# EAGLE design alig (EAGLE 7.5.0)
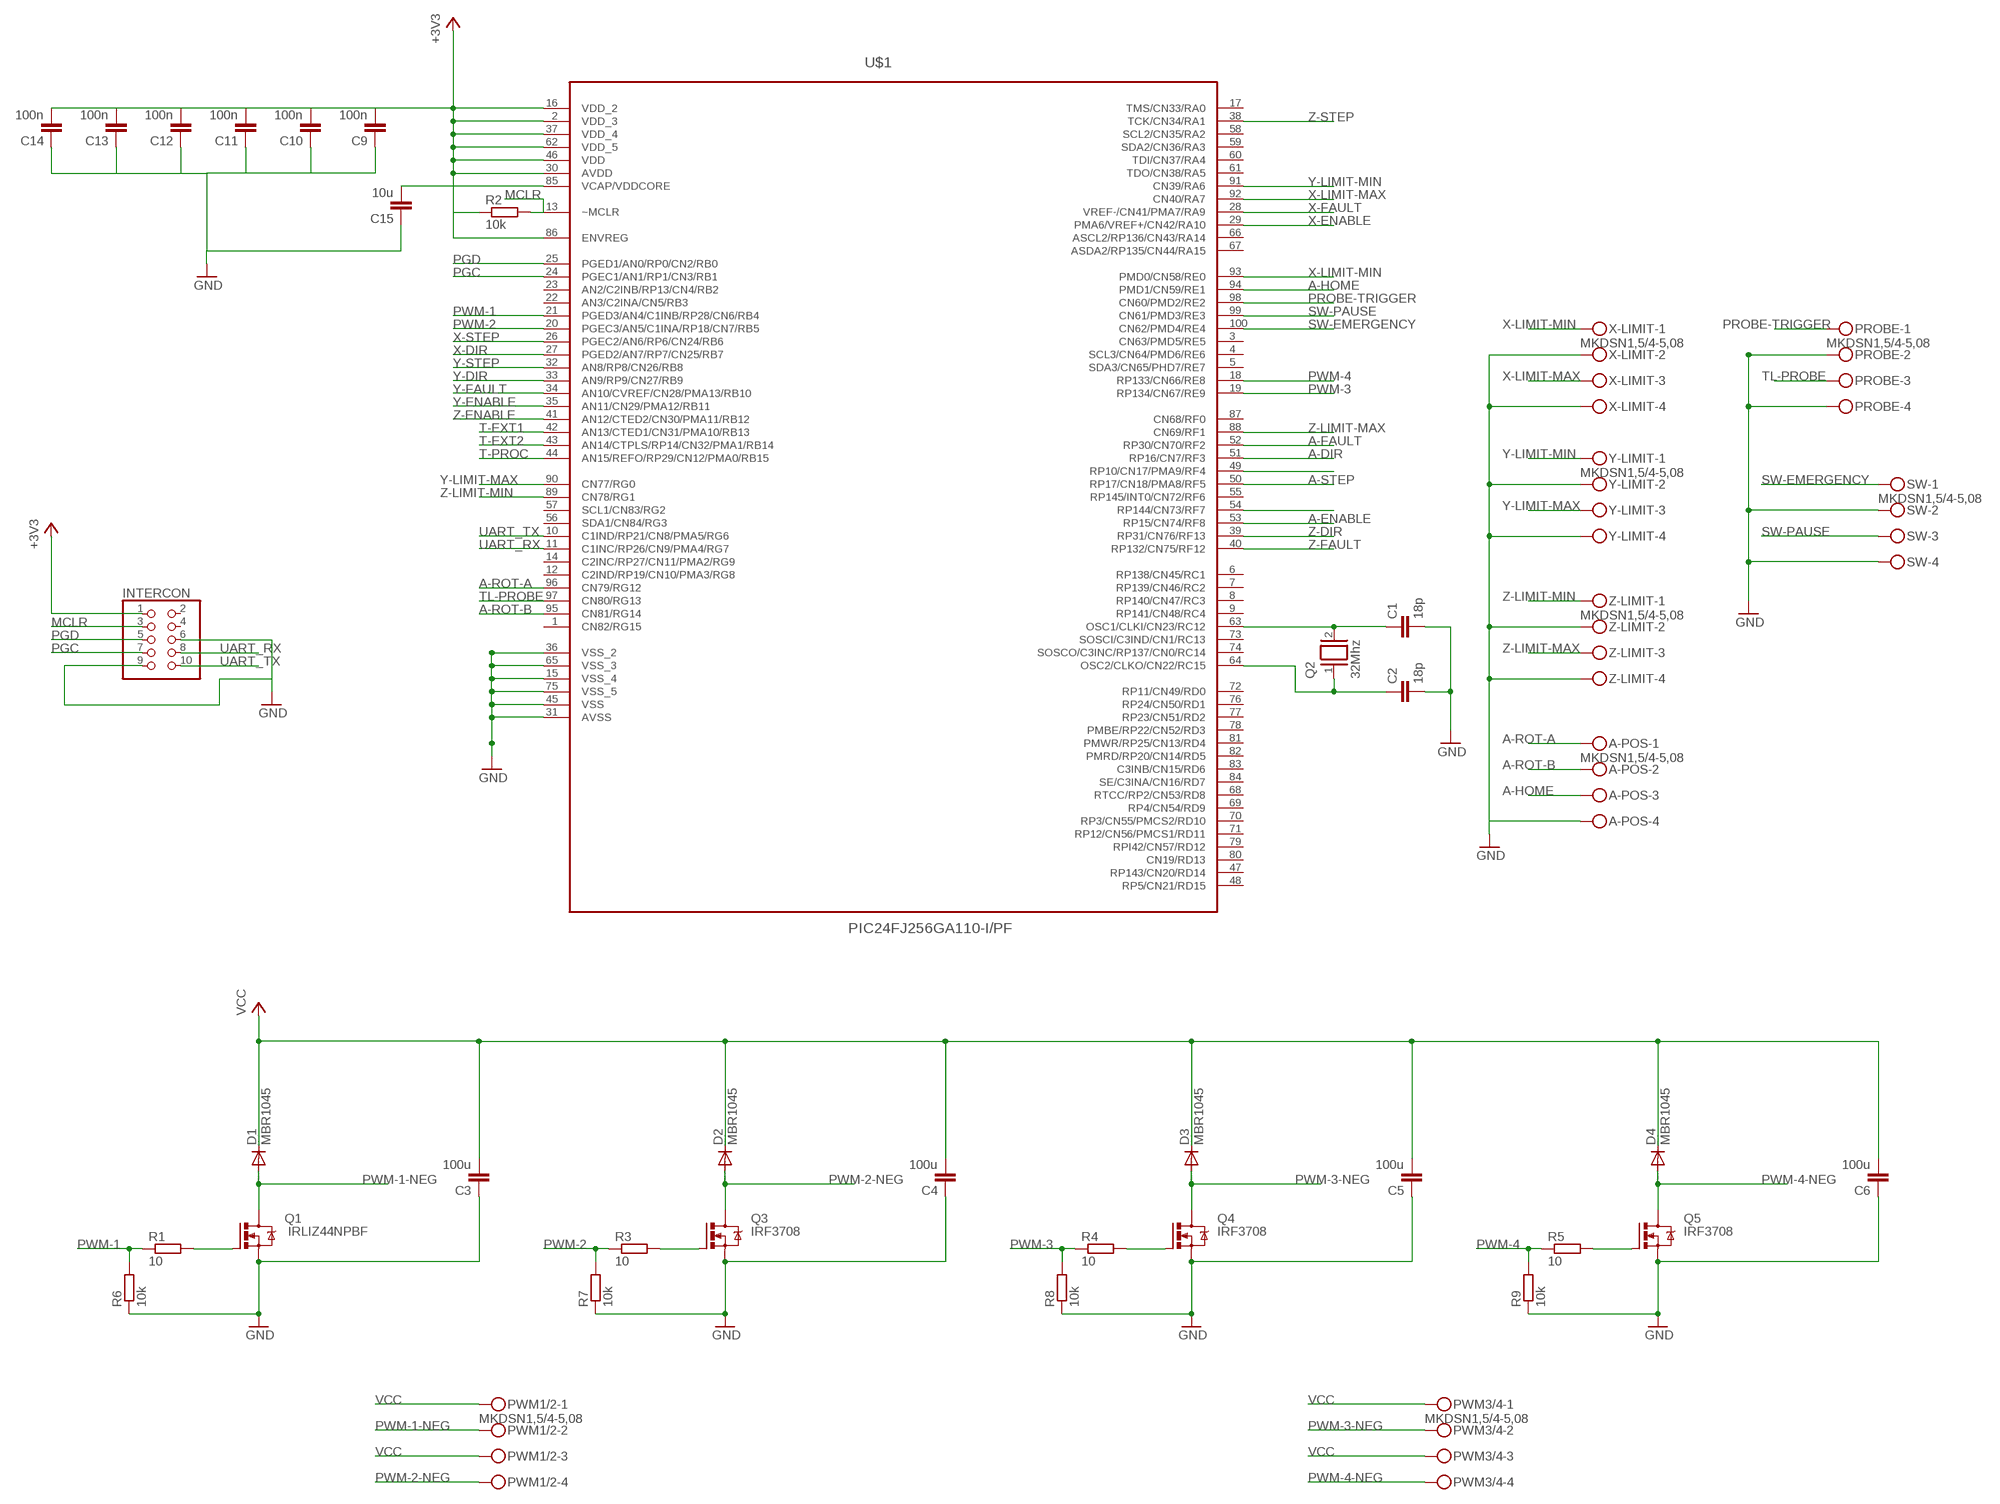
[diagram p0: schematic, sheet 1, part 1 of 3]
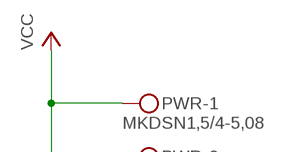
[diagram p1: schematic, sheet 1, part 2 of 3]
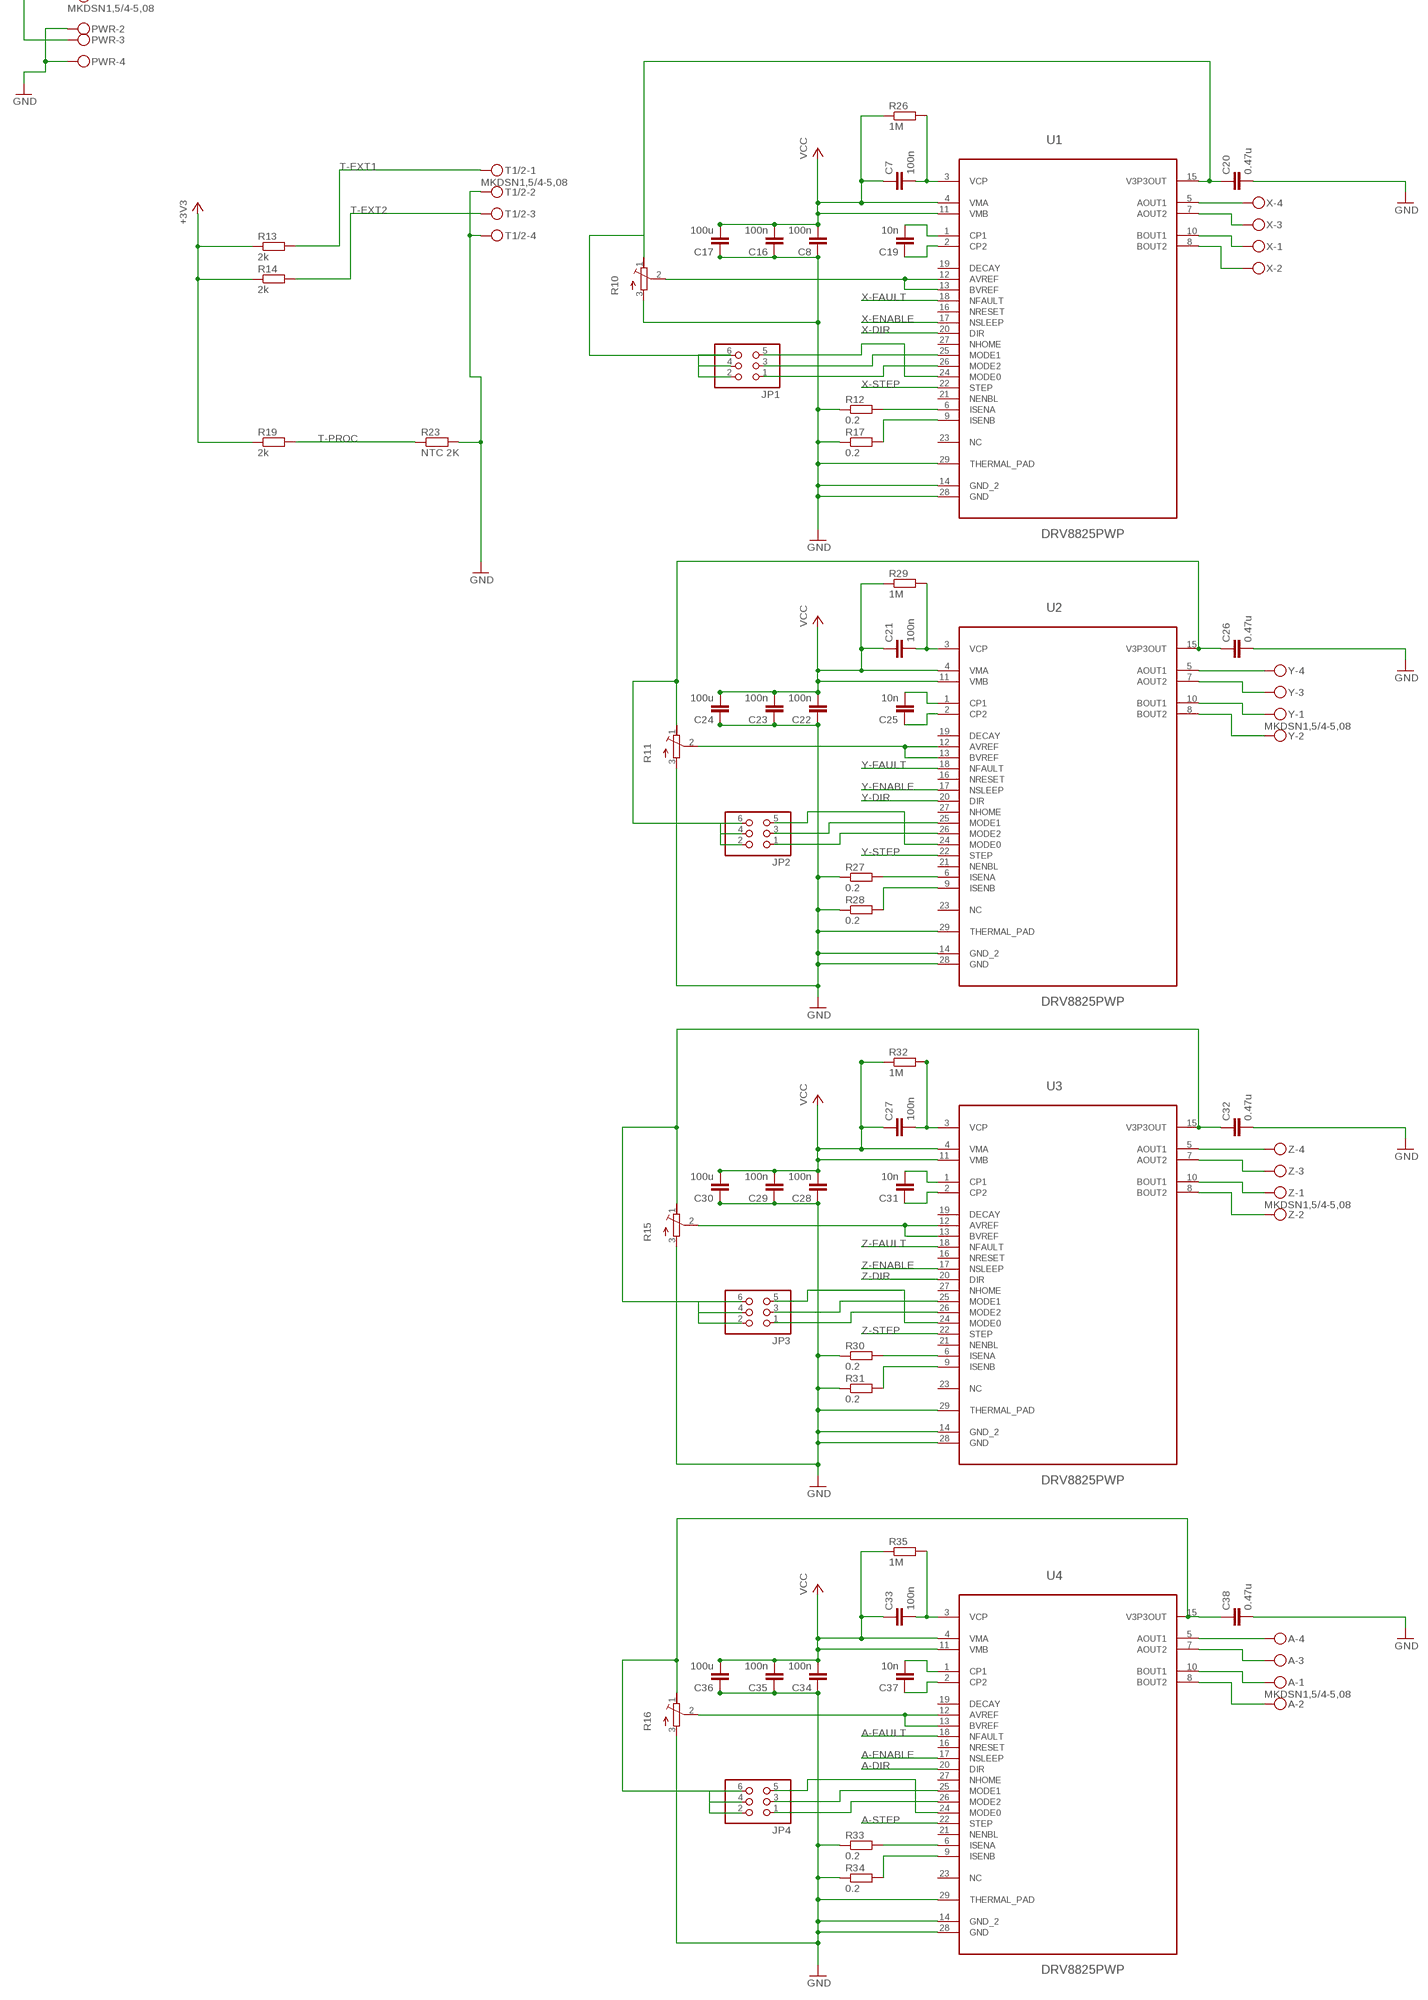
[diagram p2: schematic, sheet 1, part 3 of 3]

## Parts
A  MKDSN1,5/4-5,08  [MKDSN1,5/4-5,08]
A-POS  MKDSN1,5/4-5,08  [MKDSN1,5/4-5,08]
C1  18p  C-EUC0805  [C0805]
C2  18p  C-EUC0805  [C0805]
C3  100u  C-EUC0805  [C0805]
C4  100u  C-EUC0805  [C0805]
C5  100u  C-EUC0805  [C0805]
C6  100u  C-EUC0805  [C0805]
C7  100n  C-EUC0805  [C0805]
C8  100n  C-EUC0805  [C0805]
C9  100n  C-EUC0805  [C0805]
C10  100n  C-EUC0805  [C0805]
C11  100n  C-EUC0805  [C0805]
C12  100n  C-EUC0805  [C0805]
C13  100n  C-EUC0805  [C0805]
C14  100n  C-EUC0805  [C0805]
C15  10u  C-EUC0805  [C0805]
C16  100n  C-EUC0805  [C0805]
C17  100u  C-EUC0805  [C0805]
C19  10n  C-EUC0805  [C0805]
C20  0.47u  C-EUC0805  [C0805]
C21  100n  C-EUC0805  [C0805]
C22  100n  C-EUC0805  [C0805]
C23  100n  C-EUC0805  [C0805]
C24  100u  C-EUC0805  [C0805]
C25  10n  C-EUC0805  [C0805]
C26  0.47u  C-EUC0805  [C0805]
C27  100n  C-EUC0805  [C0805]
C28  100n  C-EUC0805  [C0805]
C29  100n  C-EUC0805  [C0805]
C30  100u  C-EUC0805  [C0805]
C31  10n  C-EUC0805  [C0805]
C32  0.47u  C-EUC0805  [C0805]
C33  100n  C-EUC0805  [C0805]
C34  100n  C-EUC0805  [C0805]
C35  100n  C-EUC0805  [C0805]
C36  100u  C-EUC0805  [C0805]
C37  10n  C-EUC0805  [C0805]
C38  0.47u  C-EUC0805  [C0805]
D1  MBR1045  BYT08P  [TO220ACS]
D2  MBR1045  BYT08P  [TO220ACS]
D3  MBR1045  BYT08P  [TO220ACS]
D4  MBR1045  BYT08P  [TO220ACS]
INTERCON  PINHD-2X5  [2X05]
JP1  PINHD-2X3  [2X03]
JP2  PINHD-2X3  [2X03]
JP3  PINHD-2X3  [2X03]
JP4  PINHD-2X3  [2X03]
PROBE  MKDSN1,5/4-5,08  [MKDSN1,5/4-5,08]
PWM1/2  MKDSN1,5/4-5,08  [MKDSN1,5/4-5,08]
PWM3/4  MKDSN1,5/4-5,08  [MKDSN1,5/4-5,08]
PWR  MKDSN1,5/4-5,08  [MKDSN1,5/4-5,08]
Q1  IRLIZ44NPBF  IRF540  [TO220BV]
Q2  32Mhz  XTAL/S  [QS]
Q3  IRF3708  IRF540  [TO220BV]
Q4  IRF3708  IRF540  [TO220BV]
Q5  IRF3708  IRF540  [TO220BV]
R1  10  R-EU_R0805  [R0805]
R2  10k  R-EU_R0805  [R0805]
R3  10  R-EU_R0805  [R0805]
R4  10  R-EU_R0805  [R0805]
R5  10  R-EU_R0805  [R0805]
R6  10k  R-EU_R0805  [R0805]
R7  10k  R-EU_R0805  [R0805]
R8  10k  R-EU_R0805  [R0805]
R9  10k  R-EU_R0805  [R0805]
R10  R-TRIMM3314J  [RTRIM3314J]
R11  R-TRIMM3314J  [RTRIM3314J]
R12  0.2  R-EU_R1206  [R1206]
R13  2k  R-EU_R0805  [R0805]
R14  2k  R-EU_R0805  [R0805]
R15  R-TRIMM3314J  [RTRIM3314J]
R16  R-TRIMM3314J  [RTRIM3314J]
R17  0.2  R-EU_R1206  [R1206]
R19  2k  R-EU_R0805  [R0805]
R23  NTC 2K  R-EU_R0805  [R0805]
R26  1M  R-EU_R0805  [R0805]
R27  0.2  R-EU_R1206  [R1206]
R28  0.2  R-EU_R1206  [R1206]
R29  1M  R-EU_R0805  [R0805]
R30  0.2  R-EU_R1206  [R1206]
R31  0.2  R-EU_R1206  [R1206]
R32  1M  R-EU_R0805  [R0805]
R33  0.2  R-EU_R1206  [R1206]
R34  0.2  R-EU_R1206  [R1206]
R35  1M  R-EU_R0805  [R0805]
SW  MKDSN1,5/4-5,08  [MKDSN1,5/4-5,08]
T1/2  MKDSN1,5/4-5,08  [MKDSN1,5/4-5,08]
U1  DRV8825PWP  [SOP65P640X120-29N]
U2  DRV8825PWP  [SOP65P640X120-29N]
U3  DRV8825PWP  [SOP65P640X120-29N]
U4  DRV8825PWP  [SOP65P640X120-29N]
U$1  PIC24FJ256GA110-I/PF  [QFP50P1600X1600X120-100N]
X  MKDSN1,5/4-5,08  [MKDSN1,5/4-5,08]
X-LIMIT  MKDSN1,5/4-5,08  [MKDSN1,5/4-5,08]
Y  MKDSN1,5/4-5,08  [MKDSN1,5/4-5,08]
Y-LIMIT  MKDSN1,5/4-5,08  [MKDSN1,5/4-5,08]
Z  MKDSN1,5/4-5,08  [MKDSN1,5/4-5,08]
Z-LIMIT  MKDSN1,5/4-5,08  [MKDSN1,5/4-5,08]

## Nets
+3V3: C9.2 C10.2 C11.2 C12.2 C13.2 C14.2 INTERCON.1 R2.1 R13.1 R14.1 R19.1 U$1.2(VDD_3) U$1.16(VDD_2) U$1.30(AVDD) U$1.37(VDD_4) U$1.46(VDD) U$1.62(VDD_5) U$1.86(ENVREG)
A-DIR: U4.20(DIR) U$1.51(RP16/CN7/RF3)
A-ENABLE: U4.17(NSLEEP) U$1.53(RP15/CN74/RF8)
A-FAULT: U4.18(NFAULT) U$1.52(RP30/CN70/RF2)
A-HOME: A-POS.3 U$1.94(PMD1/CN59/RE1)
A-ROT-A: A-POS.1 U$1.96(CN79/RG12)
A-ROT-B: A-POS.2 U$1.95(CN81/RG14)
A-STEP: U4.22(STEP) U$1.50(RP17/CN18/PMA8/RF5)
AUX-IO-3: U$1.54(RP144/CN73/RF7)
GND: A-POS.4 C1.2 C2.2 C3.1 C4.1 C5.1 C6.1 C8.1 C9.1 C10.1 C11.1 C12.1 C13.1 C14.1 C15.1 C16.1 C17.1 C20.2 C22.1 C23.1 C24.1 C26.2 C28.1 C29.1 C30.1 C32.2 C34.1 C35.1 C36.1 C38.2 INTERCON.6 INTERCON.9 PROBE.2 PROBE.4 PWR.2 PWR.4 Q1.S Q3.S Q4.S Q5.S R6.1 R7.1 R8.1 R9.1 R10.3(A) R11.3(A) R12.1 R15.3(A) R16.3(A) R17.1 R23.2 R27.1 R28.1 R30.1 R31.1 R33.1 R34.1 SW.2 SW.4 T1/2.2 T1/2.4 U1.14(GND_2) U1.28(GND) U1.29(THERMAL_PAD) U2.14(GND_2) U2.28(GND) U2.29(THERMAL_PAD) U3.14(GND_2) U3.28(GND) U3.29(THERMAL_PAD) U4.14(GND_2) U4.28(GND) U4.29(THERMAL_PAD) U$1.15(VSS_4) U$1.31(AVSS) U$1.36(VSS_2) U$1.45(VSS) U$1.65(VSS_3) U$1.75(VSS_5) X-LIMIT.2 X-LIMIT.4 Y-LIMIT.2 Y-LIMIT.4 Z-LIMIT.2 Z-LIMIT.4
MCLR: INTERCON.3 R2.2 U$1.13(~MCLR)
N$1: U1.5(AOUT1) X.4
N$2: Q3.G R3.2
N$3: Q4.G R4.2
N$4: C2.1 Q2.1 U$1.64(OSC2/CLKO/CN22/RC15)
N$5: C1.1 Q2.2 U$1.63(OSC1/CLKI/CN23/RC12)
N$6: C15.2 U$1.85(VCAP/VDDCORE)
N$7: Q1.G R1.2
N$8: Q5.G R5.2
N$9: U1.7(AOUT2) X.3
N$10: U1.10(BOUT1) X.1
N$11: U1.8(BOUT2) X.2
N$12: U2.5(AOUT1) Y.4
N$13: U2.7(AOUT2) Y.3
N$14: U2.10(BOUT1) Y.1
N$15: U2.8(BOUT2) Y.2
N$16: U3.5(AOUT1) Z.4
N$17: C21.2 R29.2 U2.3(VCP)
N$18: C25.2 U2.1(CP1)
N$19: C25.1 U2.2(CP2)
N$20: C7.2 R26.2 U1.3(VCP)
N$21: C26.1 JP2.2 JP2.4 JP2.6 R11.1(E) U2.15(V3P3OUT)
N$22: C19.2 U1.1(CP1)
N$23: C19.1 U1.2(CP2)
N$24: JP2.1 U2.26(MODE2)
N$25: R27.2 U2.6(ISENA)
N$26: R12.2 U1.6(ISENA)
N$27: R17.2 U1.9(ISENB)
N$28: R28.2 U2.9(ISENB)
N$29: U3.7(AOUT2) Z.3
N$30: U3.10(BOUT1) Z.1
N$31: U3.8(BOUT2) Z.2
N$32: A.4 U4.5(AOUT1)
N$33: C27.2 R32.2 U3.3(VCP)
N$34: C31.2 U3.1(CP1)
N$35: C31.1 U3.2(CP2)
N$36: C32.1 JP3.2 JP3.4 JP3.6 R15.1(E) U3.15(V3P3OUT)
N$37: R30.2 U3.6(ISENA)
N$38: R31.2 U3.9(ISENB)
N$39: A.3 U4.7(AOUT2)
N$40: A.1 U4.10(BOUT1)
N$41: A.2 U4.8(BOUT2)
N$42: R10.2(S) U1.12(AVREF) U1.13(BVREF)
N$43: C33.2 R35.2 U4.3(VCP)
N$44: C37.2 U4.1(CP1)
N$45: C37.1 U4.2(CP2)
N$46: C38.1 JP4.2 JP4.4 JP4.6 R16.1(E) U4.15(V3P3OUT)
N$47: R33.2 U4.6(ISENA)
N$48: R34.2 U4.9(ISENB)
N$49: JP1.5 U1.24(MODE0)
N$50: R11.2(S) U2.12(AVREF) U2.13(BVREF)
N$51: R15.2(S) U3.12(AVREF) U3.13(BVREF)
N$52: R16.2(S) U4.12(AVREF) U4.13(BVREF)
N$53: JP1.3 U1.25(MODE1)
N$54: JP2.5 U2.24(MODE0)
N$55: JP1.1 U1.26(MODE2)
N$56: C20.1 JP1.2 JP1.4 JP1.6 R10.1(E) U1.15(V3P3OUT)
N$57: JP2.3 U2.25(MODE1)
N$58: JP3.5 U3.24(MODE0)
N$59: JP3.3 U3.25(MODE1)
N$60: JP3.1 U3.26(MODE2)
N$61: JP4.5 U4.24(MODE0)
N$62: JP4.3 U4.25(MODE1)
N$63: JP4.1 U4.26(MODE2)
PGC: INTERCON.7 U$1.24(PGEC1/AN1/RP1/CN3/RB1)
PGD: INTERCON.5 U$1.25(PGED1/AN0/RP0/CN2/RB0)
PROBE-TRIGGER: PROBE.1 U$1.98(CN60/PMD2/RE2)
PWM-1: R1.1 R6.2 U$1.21(PGED3/AN4/C1INB/RP28/CN6/RB4)
PWM-1-NEG: D1.A PWM1/2.2 Q1.D
PWM-2: R3.1 R7.2 U$1.20(PGEC3/AN5/C1INA/RP18/CN7/RB5)
PWM-2-NEG: D2.A PWM1/2.4 Q3.D
PWM-3: R4.1 R8.2 U$1.19(RP134/CN67/RE9)
PWM-3-NEG: D3.A PWM3/4.2 Q4.D
PWM-4: R5.1 R9.2 U$1.18(RP133/CN66/RE8)
PWM-4-NEG: D4.A PWM3/4.4 Q5.D
SW-EMERGENCY: SW.1 U$1.100(CN62/PMD4/RE4)
SW-PAUSE: SW.3 U$1.99(CN61/PMD3/RE3)
T-EXT1: R13.2 T1/2.1 U$1.42(AN13/CTED1/CN31/PMA10/RB13)
T-EXT2: R14.2 T1/2.3 U$1.43(AN14/CTPLS/RP14/CN32/PMA1/RB14)
T-PROC: R19.2 R23.1 U$1.44(AN15/REFO/RP29/CN12/PMA0/RB15)
TL-PROBE: PROBE.3 U$1.97(CN80/RG13)
UART_RX: INTERCON.8 U$1.11(C1INC/RP26/CN9/PMA4/RG7)
UART_TX: INTERCON.10 U$1.10(C1IND/RP21/CN8/PMA5/RG6)
VCC: C3.2 C4.2 C5.2 C6.2 C7.1 C8.2 C16.2 C17.2 C21.1 C22.2 C23.2 C24.2 C27.1 C28.2 C29.2 C30.2 C33.1 C34.2 C35.2 C36.2 D1.C D2.C D3.C D4.C PWM1/2.1 PWM1/2.3 PWM3/4.1 PWM3/4.3 PWR.1 PWR.3 R26.1 R29.1 R32.1 R35.1 U1.4(VMA) U1.11(VMB) U2.4(VMA) U2.11(VMB) U3.4(VMA) U3.11(VMB) U4.4(VMA) U4.11(VMB)
X-DIR: U1.20(DIR) U$1.27(PGED2/AN7/RP7/CN25/RB7)
X-ENABLE: U1.17(NSLEEP) U$1.29(PMA6/VREF+/CN42/RA10)
X-FAULT: U1.18(NFAULT) U$1.28(VREF-/CN41/PMA7/RA9)
X-LIMIT-MAX: U$1.92(CN40/RA7) X-LIMIT.3
X-LIMIT-MIN: U$1.93(PMD0/CN58/RE0) X-LIMIT.1
X-STEP: U1.22(STEP) U$1.26(PGEC2/AN6/RP6/CN24/RB6)
Y-DIR: U2.20(DIR) U$1.33(AN9/RP9/CN27/RB9)
Y-ENABLE: U2.17(NSLEEP) U$1.35(AN11/CN29/PMA12/RB11)
Y-FAULT: U2.18(NFAULT) U$1.34(AN10/CVREF/CN28/PMA13/RB10)
Y-LIMIT-MAX: U$1.90(CN77/RG0) Y-LIMIT.3
Y-LIMIT-MIN: U$1.91(CN39/RA6) Y-LIMIT.1
Y-STEP: U2.22(STEP) U$1.32(AN8/RP8/CN26/RB8)
Z-DIR: U3.20(DIR) U$1.39(RP31/CN76/RF13)
Z-ENABLE: U3.17(NSLEEP) U$1.41(AN12/CTED2/CN30/PMA11/RB12)
Z-FAULT: U3.18(NFAULT) U$1.40(RP132/CN75/RF12)
Z-LIMIT-MAX: U$1.88(CN69/RF1) Z-LIMIT.3
Z-LIMIT-MIN: U$1.89(CN78/RG1) Z-LIMIT.1
Z-STEP: U3.22(STEP) U$1.38(TCK/CN34/RA1)
ZTL-PROBE: U$1.49(RP10/CN17/PMA9/RF4)
Unconnected: INTERCON.2 INTERCON.4 U1.16(NRESET) U1.19(DECAY) U1.21(NENBL) U1.23(NC) U1.27(NHOME) U2.16(NRESET) U2.19(DECAY) U2.21(NENBL) U2.23(NC) U2.27(NHOME) U3.16(NRESET) U3.19(DECAY) U3.21(NENBL) U3.23(NC) U3.27(NHOME) U4.16(NRESET) U4.19(DECAY) U4.21(NENBL) U4.23(NC) U4.27(NHOME) U$1.1(CN82/RG15) U$1.3(CN63/PMD5/RE5) U$1.4(SCL3/CN64/PMD6/RE6) U$1.5(SDA3/CN65/PHD7/RE7) U$1.6(RP138/CN45/RC1) U$1.7(RP139/CN46/RC2) U$1.8(RP140/CN47/RC3) U$1.9(RP141/CN48/RC4) U$1.12(C2IND/RP19/CN10/PMA3/RG8) U$1.14(C2INC/RP27/CN11/PMA2/RG9) U$1.17(TMS/CN33/RA0) U$1.22(AN3/C2INA/CN5/RB3) U$1.23(AN2/C2INB/RP13/CN4/RB2) U$1.47(RP143/CN20/RD14) U$1.48(RP5/CN21/RD15) U$1.55(RP145/INT0/CN72/RF6) U$1.56(SDA1/CN84/RG3) U$1.57(SCL1/CN83/RG2) U$1.58(SCL2/CN35/RA2) U$1.59(SDA2/CN36/RA3) U$1.60(TDI/CN37/RA4) U$1.61(TDO/CN38/RA5) U$1.66(ASCL2/RP136/CN43/RA14) U$1.67(ASDA2/RP135/CN44/RA15) U$1.68(RTCC/RP2/CN53/RD8) U$1.69(RP4/CN54/RD9) U$1.70(RP3/CN55/PMCS2/RD10) U$1.71(RP12/CN56/PMCS1/RD11) U$1.72(RP11/CN49/RD0) U$1.73(SOSCI/C3IND/CN1/RC13) U$1.74(SOSCO/C3INC/RP137/CN0/RC14) U$1.76(RP24/CN50/RD1) U$1.77(RP23/CN51/RD2) U$1.78(PMBE/RP22/CN52/RD3) U$1.79(RPI42/CN57/RD12) U$1.80(CN19/RD13) U$1.81(PMWR/RP25/CN13/RD4) U$1.82(PMRD/RP20/CN14/RD5) U$1.83(C3INB/CN15/RD6) U$1.84(SE/C3INA/CN16/RD7) U$1.87(CN68/RF0)

## Library data of the parts
A A-POS PROBE PWM1/2 PWM3/4 PWR SW T1/2 X X-LIMIT Y Y-LIMIT Z Z-LIMIT = con-phoenix-508:MKDSN1,5/4-5,08: MKDSN 1,5/ 4-5,08 Printklemme Nennstrom: 13,5 A Nennspannung: 250 V Rastermaß: 5,08 mm Polzahl: 4 Anschlussart: Schraubanschluss Montage: Löten Anschlussrichtung Leiter/Platine: 0 ° Artikelnummer: 1729144 Source: http://eshop.phoenixcontact.com .. 1729144.pdf
C1-C17 C19-C38 = resistor:C-EU: CAPACITOR, European symbol
D1-D4 = diode:BYT08P: DIODE ultra fast
INTERCON = pinhead:PINHD-2X5: PIN HEADER
JP1-JP4 = pinhead:PINHD-2X3: PIN HEADER
Q1 Q3-Q5 = transistor-power:IRF540: HEXFET Power MOSFET
Q2 = special:XTAL/S: CRYSTAL
R1-R9 R13 R14 R19 R23 R26 R29 R32 R35 = resistor:R-EU_: RESISTOR, European symbol
R10 R11 R15 R16 = rcl:R-TRIMM: Trimm resistor
R12 R17 R27 R28 R30 R31 R33 R34 = rcl:R-EU_: RESISTOR, European symbol
U1-U4 = DRV8825:DRV8825PWP: STEPPER MOTOR CONTROLLER IC,HTSSOP-28; MPN: DRV8825PWP; OC_FARNELL: 1903642; OC_NEWARK: 48T4143; PACKAGE: HTSSOP-28; SUPPLIER: TEXAS INSTRUMENTS
U$1 = pic24fj256ga110:PIC24FJ256GA110-I/PF: IC, 16BIT MCU; DESCRIPTION: IC, 16BIT MCU; MPN: PIC24FJ256GA110-I/PF; OC_FARNELL: 1576866; OC_NEWARK: 54M5125; PACKAGE: TQFP-100; SUPPLIER: Microchip

## Board
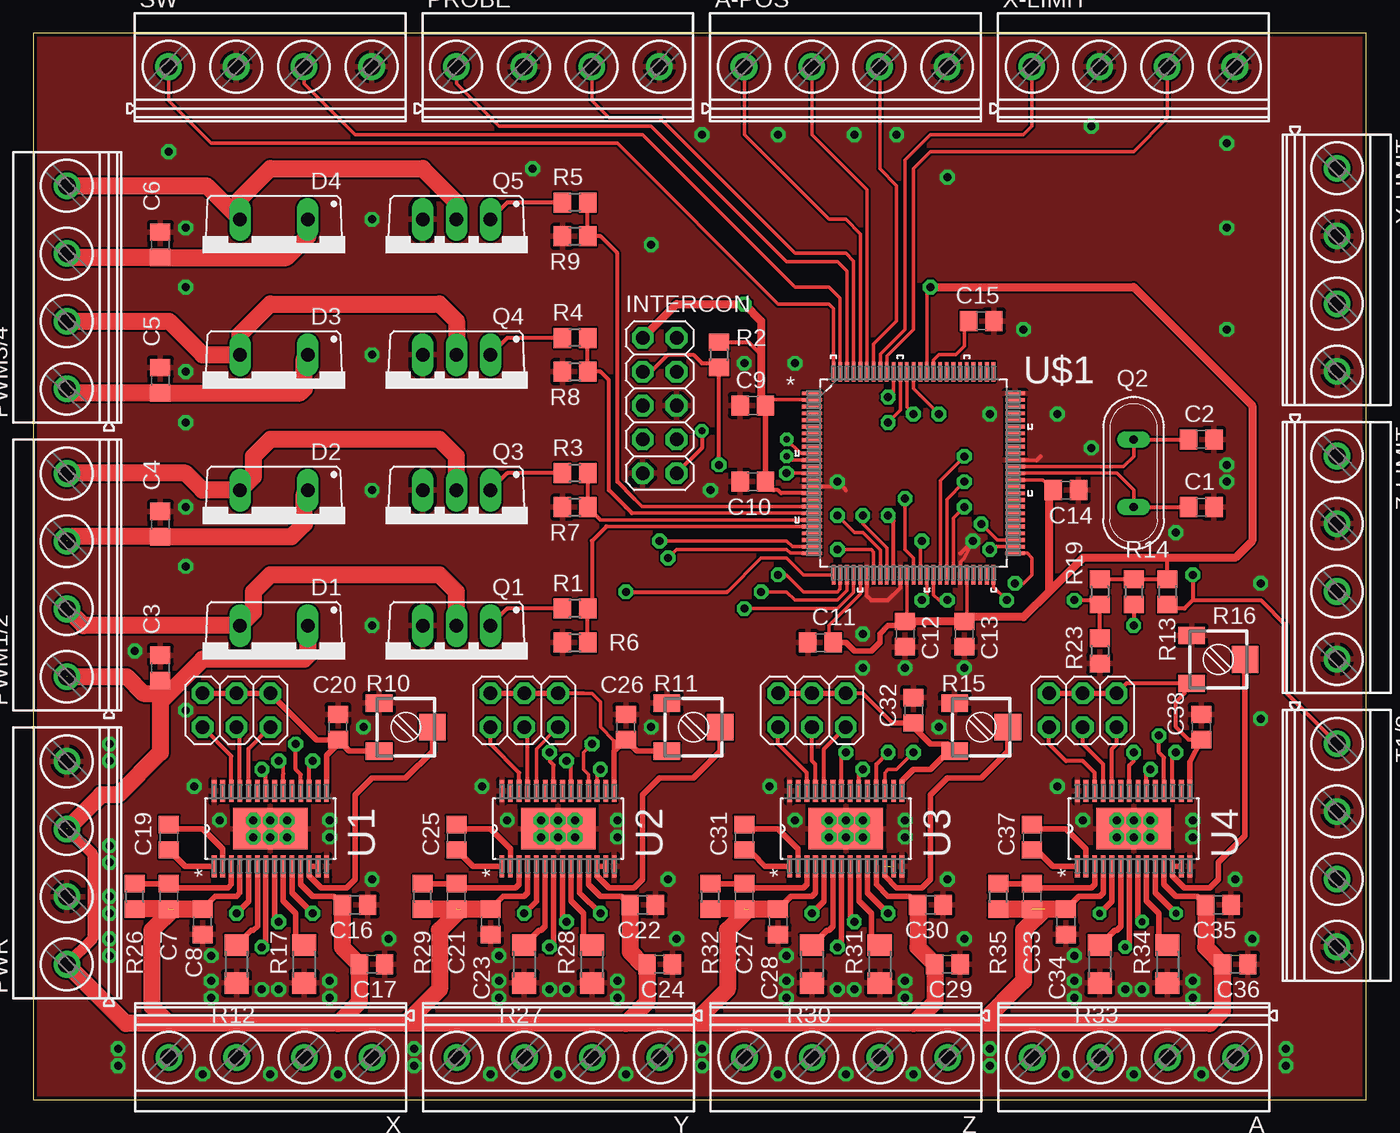
[diagram p3: board, top side]
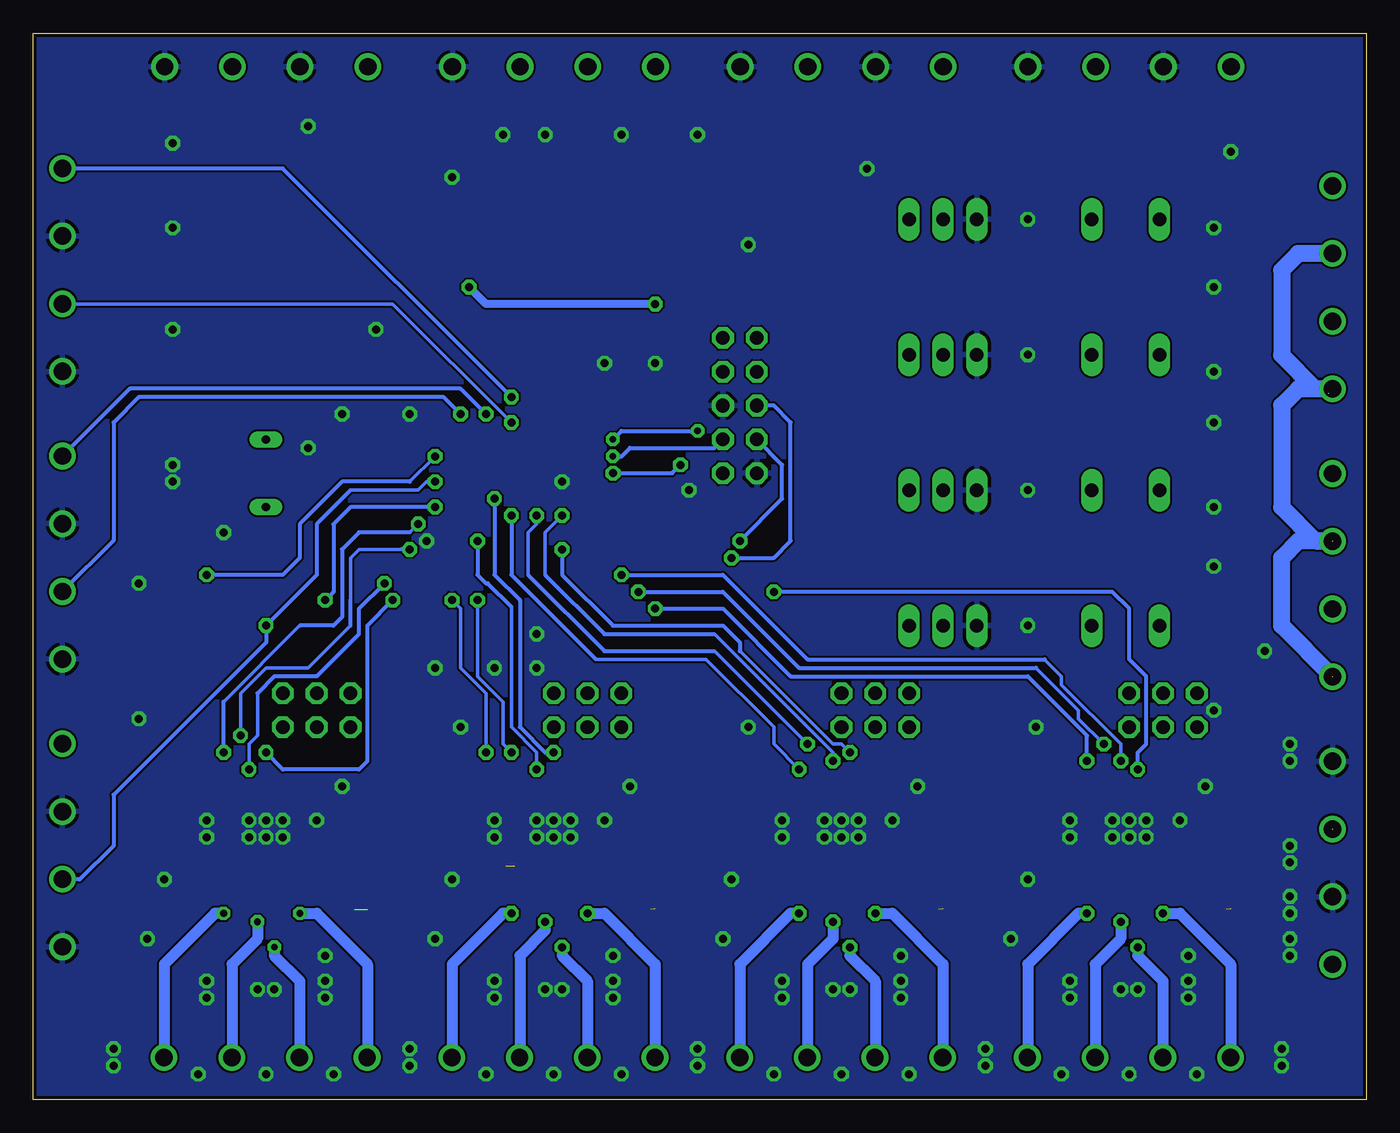
[diagram p4: board, bottom side, seen from below]

Size 100 x 80 mm. Coordinates in mm from the lower left corner, seen from the top.
Outline: 0,0 100,0 100,80 0,80 0,0
Copper layers (1*16): Top 0.035mm / dielectric 1.5mm / Bottom 0.035mm
Design rules "SparkFun *": minimum track width 8mil, minimum drill 20mil, track to track 6mil, track to pad 8mil, pad to pad 8mil, via to via 8mil, smd to smd 8mil, copper to edge 10mil, drill to drill 8mil, minimum pad ring 12mil, minimum via ring 10mil, stop-mask expansion 4mil, vias tented up to drill 25mil, thermal gap 10mil

### Footprints (pad centres in the part's own frame; a part is rotated, then mirrored left to right if it is on the bottom)
MKDSN1,5/4-5,08 = drill 1.3 pad 2: 1 -7.641,0.025; 2 -2.561,0.025; 3 2.519,0.025; 4 7.599,0.025
C0805 = smd 1.3 x 1.5: 1 -0.95,0; 2 0.95,0
TO220ACS = drill 1.016 long: A 2.54,-2.54; C -2.54,-2.54
2X05 = drill 1.016 octagon: 1 -5.08,-1.27; 2 -5.08,1.27; 3 -2.54,-1.27; 4 -2.54,1.27; 5 0,-1.27; 6 0,1.27; 7 2.54,-1.27; 8 2.54,1.27; 9 5.08,-1.27; 10 5.08,1.27
2X03 = drill 1.016 octagon: 1 -2.54,-1.27; 2 -2.54,1.27; 3 0,-1.27; 4 0,1.27; 5 2.54,-1.27; 6 2.54,1.27
TO220BV = drill 1.016 long: D 0,-2.54; G -2.54,-2.54; S 2.54,-2.54
QS = drill 0.61 long: 1 -2.54,0; 2 2.54,0
R0805 = smd 1.3 x 1.5: 1 -0.95,0; 2 0.95,0
RTRIM3314J = smd 1.3 x 2: 1 1.8,-2; 3 -1.8,-2 | smd 2 x 2: 2 0,2
R1206 = smd 1.6 x 1.803: 1 -1.422,0; 2 1.422,0
SOP65P640X120-29N = smd 1.651 x 0.356: 1 -2.819,4.216; 2 -2.819,3.581; 3 -2.819,2.921; 4 -2.819,2.286; 5 -2.819,1.626; 6 -2.819,0.965; 7 -2.819,0.33; 8 -2.819,-0.33; 9 -2.819,-0.965; 10 -2.819,-1.626; 11 -2.819,-2.286; 12 -2.819,-2.921; 13 -2.819,-3.581; 14 -2.819,-4.216; 15 2.819,-4.216; 16 2.819,-3.581; 17 2.819,-2.921; 18 2.819,-2.286; 19 2.819,-1.626; 20 2.819,-0.965; 21 2.819,-0.33; 22 2.819,0.33; 23 2.819,0.965; 24 2.819,1.626; 25 2.819,2.286; 26 2.819,2.921; 27 2.819,3.581; 28 2.819,4.216 | smd 3.099 x 5.588: 29 0,0
QFP50P1600X1600X120-100N = smd 1.473 x 0.279: 1 -7.62,5.994; 2 -7.62,5.512; 3 -7.62,5.004; 4 -7.62,4.496; 5 -7.62,3.988; 6 -7.62,3.505; 7 -7.62,2.997; 8 -7.62,2.489; 9 -7.62,2.007; 10 -7.62,1.499; 11 -7.62,0.991; 12 -7.62,0.508; 13 -7.62,0; 14 -7.62,-0.508; 15 -7.62,-0.991; 16 -7.62,-1.499; 17 -7.62,-2.007; 18 -7.62,-2.489; 19 -7.62,-2.997; 20 -7.62,-3.505; 21 -7.62,-3.988; 22 -7.62,-4.496; 23 -7.62,-5.004; 24 -7.62,-5.512; 25 -7.62,-5.994; 51 7.62,-5.994; 52 7.62,-5.512; 53 7.62,-5.004; 54 7.62,-4.496; 55 7.62,-3.988; 56 7.62,-3.505; 57 7.62,-2.997; 58 7.62,-2.489; 59 7.62,-2.007; 60 7.62,-1.499; 61 7.62,-0.991; 62 7.62,-0.508; 63 7.62,0; 64 7.62,0.508; 65 7.62,0.991; 66 7.62,1.499; 67 7.62,2.007; 68 7.62,2.489; 69 7.62,2.997; 70 7.62,3.505; 71 7.62,3.988; 72 7.62,4.496; 73 7.62,5.004; 74 7.62,5.512; 75 7.62,5.994 | smd 0.279 x 1.473: 26 -5.994,-7.62; 27 -5.512,-7.62; 28 -5.004,-7.62; 29 -4.496,-7.62; 30 -3.988,-7.62; 31 -3.505,-7.62; 32 -2.997,-7.62; 33 -2.489,-7.62; 34 -2.007,-7.62; 35 -1.499,-7.62; 36 -0.991,-7.62; 37 -0.508,-7.62; 38 0,-7.62; 39 0.508,-7.62; 40 0.991,-7.62; 41 1.499,-7.62; 42 2.007,-7.62; 43 2.489,-7.62; 44 2.997,-7.62; 45 3.505,-7.62; 46 3.988,-7.62; 47 4.496,-7.62; 48 5.004,-7.62; 49 5.512,-7.62; 50 5.994,-7.62; 76 5.994,7.62; 77 5.512,7.62; 78 5.004,7.62; 79 4.496,7.62; 80 3.988,7.62; 81 3.505,7.62; 82 2.997,7.62; 83 2.489,7.62; 84 2.007,7.62; 85 1.499,7.62; 86 0.991,7.62; 87 0.508,7.62; 88 0,7.62; 89 -0.508,7.62; 90 -0.991,7.62; 91 -1.499,7.62; 92 -2.007,7.62; 93 -2.489,7.62; 94 -2.997,7.62; 95 -3.505,7.62; 96 -3.988,7.62; 97 -4.496,7.62; 98 -5.004,7.62; 99 -5.512,7.62; 100 -5.994,7.62

### Placement (x,y rotation side)
A  82.55,3.17 180 top
A-POS  60.96,77.47 0 top
C1  87.63,44.45 0 top
C2  87.63,49.53 0 top
C3  9.53,32.38 270 top
C4  9.53,43.18 270 top
C5  9.53,53.98 270 top
C6  9.53,64.14 270 top
C7  10.16,15.24 90 top
C8  12.7,13.34 90 top
C9  53.98,52.07 0 top
C10  53.98,46.35 0 top
C11  59.05,34.29 0 top
C12  65.41,34.92 90 top
C13  69.85,34.92 90 top
C14  77.47,45.72 180 top
C15  71.12,58.42 180 top
C16  24.13,14.61 180 top
C17  25.4,10.16 180 top
C19  10.16,19.68 270 top
C20  22.86,27.94 90 top
C21  31.75,15.24 90 top
C22  45.72,14.61 180 top
C23  34.29,13.34 90 top
C24  46.99,10.16 180 top
C25  31.75,19.68 270 top
C26  44.45,27.94 90 top
C27  53.34,15.24 90 top
C28  55.88,13.34 90 top
C29  68.58,10.16 180 top
C30  67.31,14.61 180 top
C31  53.34,19.68 270 top
C32  66.04,29.21 90 top
C33  74.93,15.24 90 top
C34  77.47,13.34 90 top
C35  88.9,14.61 180 top
C36  90.17,10.16 180 top
C37  74.93,19.68 270 top
C38  87.63,27.94 90 top
D1  18.05,33.02 180 top
D2  18.05,43.18 180 top
D3  18.05,53.34 180 top
D4  18.05,63.5 180 top
INTERCON  46.99,52.07 270 top
JP1  15.24,29.21 0 top
JP2  36.83,29.21 0 top
JP3  58.42,29.21 0 top
JP4  78.74,29.21 0 top
PROBE  39.37,77.47 0 top
PWM1/2  2.54,39.37 90 top
PWM3/4  2.54,60.96 90 top
PWR  2.54,17.78 90 top
Q1  31.75,33.02 180 top
Q2  82.55,46.99 270 top
Q3  31.75,43.18 180 top
Q4  31.75,53.34 180 top
Q5  31.75,63.5 180 top
R1  40.64,36.83 180 top
R2  51.44,55.88 270 top
R3  40.64,46.99 180 top
R4  40.64,57.15 180 top
R5  40.64,67.31 180 top
R6  40.64,34.29 0 top
R7  40.64,44.45 0 top
R8  40.64,54.61 0 top
R9  40.64,64.77 0 top
R10  27.94,27.94 270 top
R11  49.53,27.94 270 top
R12  15.24,10.16 90 top
R13  85.09,38.1 270 top
R14  82.55,38.1 270 top
R15  71.12,27.94 270 top
R16  88.9,33.02 270 top
R17  20.32,10.16 90 top
R19  80.01,38.1 270 top
R23  80.01,33.66 270 top
R26  7.62,15.24 90 top
R27  36.83,10.16 90 top
R28  41.91,10.16 90 top
R29  29.21,15.24 90 top
R30  58.42,10.16 90 top
R31  63.5,10.16 90 top
R32  50.8,15.24 90 top
R33  80.01,10.16 90 top
R34  85.09,10.16 90 top
R35  72.39,15.24 90 top
SW  17.78,77.47 0 top
T1/2  97.79,19.05 270 top
U1  17.78,20.32 90 top
U2  39.37,20.32 90 top
U3  60.96,20.32 90 top
U4  82.55,20.32 90 top
U$1  66.04,46.99 0 top
X  17.78,3.17 180 top
X-LIMIT  82.55,77.47 0 top
Y  39.37,3.17 180 top
Y-LIMIT  97.79,62.23 270 top
Z  60.96,3.17 180 top
Z-LIMIT  97.79,40.64 270 top

### Tracks (layer width: path | path; a pad name or v marks a point on that pad's centre or on a via)
+3V3  (via drill 0.6)
  Top 0.254: U$1.86 67.03,60.68 v67.31,60.96 | U$1.62 75.76,46.48 C14.2 | U$1.46 70.03,36.05 | 65.53,36.38 U$1.37 65.53,36.07 66.04,35.56 | U$1.30 62.05,37.92 59.69,35.56 59.69,34.29 C11.2 | U$1.2 55.36,52.5
  Top 0.305: 55.36,52.5 C9.2 | R2.1 53.66,56.83 54.61,55.88 | U$1.16 56.11,45.49 55.88,45.72 55.56,45.72 C10.2 | 70.03,36.05 C13.2 | 65.53,36.38 66.04,35.88 | 85.09,40.64 R13.1 R14.1 R19.1 | 59.69,34.6 C11.2
  Top 0.406: C9.2 C10.2 | 66.04,35.56 64.14,35.56 63.5,34.92 63.5,34.29 62.87,33.66 61.59,33.66 60.96,34.29 C11.2
  Top 0.61: INTERCON.1 48.26,59.69 v53.34,59.69 54.61,58.42 54.61,55.88 54.61,52.38 C9.2 | 76.2,38.1 76.2,45.4 C14.2 | 76.2,38.1 74.3,36.2 70.17,36.2 C13.2 66.04,35.88 C12.2 | 76.2,38.1 78.74,40.64 85.09,40.64 90.17,40.64 91.44,41.91 91.44,52.07 82.55,60.96 v67.31,60.96
  Bottom 0.61: v53.34,59.69 66.04,59.69 v67.31,60.96
A-DIR  (via drill 0.6)
  Top 0.254: U$1.51 74.57,41 74.93,40.64 74.93,39.37 74.3,38.73 v73.66,38.73
  Top 0.305: U4.20 83.52,24.46 v83.82,24.77
  Bottom 0.254: v83.82,24.77 83.82,26.67 83.19,27.3 83.19,30.48
  Bottom 0.305: v73.66,38.73 75.56,36.83 75.56,34.92 78.74,31.75 81.92,31.75 83.19,30.48
A-ENABLE  (via drill 0.6)
  Top 0.254: U$1.53 72.31,41.99 v71.12,43.18
  Top 0.305: U4.17 85.47,25.78 v85.72,26.04
  Bottom 0.254: v71.12,43.18 71.75,42.55 | 85.72,29.84 80.01,35.56
  Bottom 0.305: 71.75,42.55 75.56,42.55 76.83,41.27 76.83,36.2 77.47,35.56 80.01,35.56 | v85.72,26.04 85.72,29.84
A-FAULT  (via drill 0.6)
  Top 0.254: U$1.52 71.96,41.48 v71.75,41.27
  Top 0.305: U4.18 84.84,25.65 84.45,26.04 v84.45,27.3
  Bottom 0.254: 72.39,41.27 75.56,41.27 76.2,40.64 76.2,37.47 | 76.2,35.56 79.38,32.38 82.55,32.38 84.45,30.48 v84.45,27.3
  Bottom 0.305: 76.2,35.56 76.2,37.47 | v71.75,41.27 72.39,41.27
A-HOME
  Top 0.254: U$1.94 63.04,56.69 64.77,58.42 64.77,68.58 63.5,69.85 63.5,77.47 A-POS.3
A-ROT-A
  Top 0.254: U$1.96 62.05,64.95 60.96,66.04 59.69,66.04 53.34,72.39 53.34,77.47 A-POS.1
A-ROT-B
  Top 0.254: U$1.95 62.53,68.28 58.42,72.39 58.42,77.47 A-POS.2
A-STEP  (via drill 0.6)
  Top 0.254: U$1.50 72.03,38.46 v73.03,37.47
  Top 0.305: U4.22 82.22,25.07 82.55,25.4 v82.55,26.04
  Bottom 0.305: v73.03,37.47 74.93,35.56 74.93,25.4 75.56,24.77 81.28,24.77 v82.55,26.04
GND  (via drill 0.6)
  Top 0.254: U$1.65 75.29,47.98 | U$1.45 69.55,40.34 69.85,40.64 v70.48,41.91 | U$1.36 65.05,38.38 | U$1.15 59.97,46 v60.33,46.35 | U$1.31 62.53,37.8
  Top 0.305: 62.53,37.8 62.87,37.47 64.14,37.47 65.05,38.38 | 60.96,45.72 v60.33,46.35 | 75.29,47.98 75.56,48.26 | 69.55,40.97 v70.48,41.91
  other vias: 13.34,8.89 13.34,7.62 17.14,8.26 18.41,8.26 22.23,8.89 22.23,7.62 13.34,10.79 26.67,12.06 25.4,16.51 22.23,20.95 22.23,19.68 16.51,20.95 17.78,20.95 19.05,20.95 19.05,19.68 17.78,19.68 16.51,19.68 13.97,20.95 12.06,23.5 48.26,12.06 43.81,8.89 43.81,7.62 40.01,8.26 38.73,8.26 34.92,8.89 34.92,7.62 34.92,10.79 35.56,20.95 33.66,23.5 38.1,20.95 39.37,20.95 40.64,20.95 40.64,19.68 39.37,19.68 38.1,19.68 43.81,20.95 43.81,19.68 47.62,16.51 69.85,12.06 68.58,16.51 65.41,8.89 65.41,7.62 61.59,8.26 60.33,8.26 56.52,8.89 56.52,7.62 56.52,10.79 55.24,23.5 57.15,20.95 59.69,20.95 60.96,20.95 62.23,20.95 62.23,19.68 60.96,19.68 59.69,19.68 65.41,20.95 65.41,19.68 90.17,16.51 91.44,12.06 87,8.89 87,7.62 83.19,8.26 81.92,8.26 78.11,8.89 78.11,7.62 78.11,10.79 78.74,20.95 76.83,23.5 81.28,20.95 82.55,20.95 83.82,20.95 83.82,19.68 82.55,19.68 81.28,19.68 87,20.95 87,19.68 6.35,3.81 6.35,2.54 28.57,3.81 28.57,2.54 5.71,26.67 5.71,25.4 5.71,19.05 5.71,17.78 5.71,15.24 5.71,13.97 5.71,12.06 5.71,10.79 50.16,3.81 50.16,2.54 71.75,3.81 71.75,2.54 66.04,1.91 60.96,1.91 55.88,1.91 44.45,1.91 39.37,1.91 34.29,1.91 22.86,1.91 17.78,1.91 12.7,1.91 77.47,1.91 82.55,1.91 87.63,1.91 93.98,3.81 93.98,2.54 7.62,33.66 11.43,44.45 11.43,54.61 11.43,65.41 11.43,50.8 11.43,40.01 11.43,29.21 50.8,45.72 57.15,55.24 71.75,51.44 76.83,51.44 74.3,57.78 89.53,47.62 89.53,46.35 67.94,27.94 46.35,27.94 24.77,27.94 55.88,72.39 61.59,72.39 68.58,69.22 79.38,73.03 89.53,71.75 89.53,65.41 89.53,57.78 92.08,38.73 65.41,32.38 69.85,32.38 53.34,55.24 79.38,48.9 85.72,42.55 62.23,34.92 62.23,32.38 10.16,71.12 92.08,28.57 64.77,72.39 50.16,72.39 37.47,69.85 46.35,64.14 25.4,66.04 25.4,55.88 25.4,35.56 25.4,45.72 11.43,60.96
  pour Top: -10.16,83.82 -10.16,-3.81 113.03,-3.81 113.03,83.82
  pour Bottom: -6.35,83.82 114.3,83.82 114.3,-7.62 -6.35,-7.62
MCLR  (via drill 0.6)
  Top 0.254: U$1.13 v56.52,46.99
  Top 0.305: INTERCON.3 46.35,54.61 47.62,55.88 49.53,55.88 50.16,55.24 51.12,55.24 R2.2 v51.44,47.62
  Bottom 0.305: v56.52,46.99 52.07,46.99 v51.44,47.62
N$1  (via drill 0.6)
  Top 0.406: U1.5 16.15,14.88 v15.24,13.97
  Bottom 0.813: v15.24,13.97 13.97,13.97 10.16,10.16 10.16,2.54 X.4
N$2
  Top 0.305: R3.2 35.56,46.99 Q3.G
N$3
  Top 0.305: R4.2 35.56,57.15 Q4.G
N$4
  Top 0.254: U$1.64 81.79,47.5 82.55,48.26 Q2.1
  Top 0.305: Q2.1 C2.1
N$5
  Top 0.254: U$1.63 81.28,46.99 82.55,45.72 Q2.2
  Top 0.305: Q2.2 C1.1
N$6
  Top 0.254: U$1.85 67.54,55.47 67.94,55.88 69.22,55.88 69.85,56.52 69.85,58.1
  Top 0.305: 69.85,58.1 C15.2
N$7
  Top 0.305: R1.2 35.56,36.83 Q1.G
N$8
  Top 0.305: R5.2 35.56,67.31 Q5.G
N$9  (via drill 0.6)
  Top 0.406: U1.7 17.45,11.73 v17.14,11.43
  Bottom 0.813: v17.14,11.43 17.14,10.79 15.24,8.89 15.24,2.54 X.3
N$10  (via drill 0.6)
  Top 0.406: U1.10 19.41,15.52 v20.95,13.97
  Bottom 0.813: X.1 25.4,3.17 25.4,10.16 21.59,13.97 v20.95,13.97
N$11  (via drill 0.6)
  Top 0.406: U1.8 18.11,13.64 v18.41,13.34
  Bottom 0.813: v18.41,13.34 18.41,12.06 20.32,10.16 20.32,2.54 X.2
N$12  (via drill 0.6)
  Top 0.406: U2.5 37.74,14.88 v36.83,13.97
  Bottom 0.813: v36.83,13.97 35.56,13.97 31.75,10.16 31.75,3.17 Y.4
N$13  (via drill 0.6)
  Top 0.406: U2.7 39.04,11.73 v38.73,11.43
  Bottom 0.813: v38.73,11.43 38.73,10.79 36.83,8.89 36.83,3.17 Y.3
N$14  (via drill 0.6)
  Top 0.406: U2.10 41,15.52 v42.55,13.97
  Bottom 0.813: v42.55,13.97 43.18,13.97 46.99,10.16 46.99,3.17 Y.1
N$15  (via drill 0.6)
  Top 0.406: U2.8 39.7,13.64 v40.01,13.34
  Bottom 0.813: v40.01,13.34 40.01,12.06 41.91,10.16 41.91,3.17 Y.2
N$16  (via drill 0.6)
  Top 0.406: U3.5 59.33,14.88 v58.42,13.97
  Bottom 0.813: v58.42,13.97 57.15,13.97 53.34,10.16 53.34,3.17 Z.4
N$17
  Top 0.406: U2.3 36.45,16.13 36.2,15.88 32.06,15.88 C21.2 R29.2
N$18
  Top 0.406: U2.1 32.98,17.5 C25.2
N$19
  Top 0.406: U2.2 35.79,18.82 34.29,20.32 32.06,20.32 C25.1
N$20
  Top 0.406: U1.3 14.86,16.13 14.61,15.88 10.47,15.88 C7.2 R26.2
N$21
  Top 0.254: 43.59,26.9 42.55,27.94 42.55,29.84 41.91,30.48 41.27,30.48
  Top 0.305: 43.59,26.13 43.59,26.9 | 41.27,30.48 JP2.6
  Top 0.406: R11.1 45.3,26.14 C26.1 43.59,26.13 U2.15 | JP2.6 JP2.4 JP2.2
N$22
  Top 0.406: U1.1 11.39,17.5 C19.2
N$23
  Top 0.406: U1.2 14.2,18.82 12.7,20.32 10.47,20.32 C19.1
N$24
  Top 0.305: U2.26 36.45,24.51 34.29,26.67 JP2.1
N$25
  Top 0.406: U2.6 38.41,13.01 38.1,12.7 37.95,12.7 R27.2
N$26
  Top 0.406: U1.6 16.82,13.01 16.51,12.7 16.36,12.7 R12.2
N$27
  Top 0.406: U1.9 18.75,14.91 19.68,13.97 19.68,12.22 19.76,12.14 R17.2
N$28
  Top 0.406: U2.9 40.34,14.91 41.27,13.97 41.27,12.22 R28.2
N$29  (via drill 0.6)
  Top 0.406: U3.7 60.63,11.73 v60.33,11.43
  Bottom 0.813: v60.33,11.43 60.33,10.79 58.42,8.89 58.42,3.17 Z.3
N$30  (via drill 0.6)
  Top 0.406: U3.10 62.59,15.52 v64.14,13.97
  Bottom 0.813: v64.14,13.97 64.77,13.97 68.58,10.16 68.58,3.17 Z.1
N$31  (via drill 0.6)
  Top 0.406: U3.8 61.29,13.64 v61.59,13.34
  Bottom 0.813: v61.59,13.34 61.59,12.7 63.5,10.79 63.5,3.17 Z.2
N$32  (via drill 0.5)
  Top 0.406: U4.5 80.92,14.88 v80.01,13.97
  Bottom 0.813: v80.01,13.97 78.74,13.97 74.93,10.16 74.93,3.17 A.4
N$33
  Top 0.406: R32.2 C27.2 53.66,15.88 57.78,15.88 58.04,16.13 U3.3
N$34
  Top 0.406: U3.1 54.89,17.5 53.98,18.41 53.66,18.41 C31.2
N$35
  Top 0.406: U3.2 57.38,18.82 55.88,20.32 53.66,20.32 C31.1
N$36
  Top 0.305: 64.45,28.26 62.23,30.48 JP3.6
  Top 0.406: JP3.2 JP3.4 JP3.6 | U3.15 65.18,23.9 66.04,24.77 67.31,24.77 68.58,26.04 69.02,26.04 R15.1 68.59,26.67 67.31,26.67 66.04,27.94 C32.1 64.45,28.26
N$37
  Top 0.406: U3.6 59.99,13.01 59.69,12.7 59.54,12.7 R30.2
N$38
  Top 0.406: U3.9 61.92,14.91 62.87,13.97 62.87,12.22 R31.2
N$39  (via drill 0.5)
  Top 0.406: U4.7 82.22,11.73 v81.92,11.43
  Bottom 0.813: v81.92,11.43 81.92,10.79 80.01,8.89 80.01,3.17 A.3
N$40  (via drill 0.5)
  Top 0.406: U4.10 84.18,15.52 v85.72,13.97
  Bottom 0.813: v85.72,13.97 86.36,13.97 90.17,10.16 90.17,3.17 A.1
N$41  (via drill 0.5)
  Top 0.406: U4.8 82.88,13.64 v83.19,13.34
  Bottom 0.813: v83.19,13.34 83.19,12.06 85.09,10.16 85.09,3.17 A.2
N$42
  Top 0.406: U1.13 U1.12 20.7,16.76 21.59,15.88 23.5,15.88 24.13,16.51 24.13,22.86 25.4,24.13 27.94,24.13 29.94,26.13 R10.2
N$43
  Top 0.406: U4.3 79.63,16.13 79.38,15.88 75.25,15.88 C33.2 R35.2
N$44
  Top 0.406: U4.1 76.48,17.5 75.56,18.41 75.25,18.41 C37.2
N$45
  Top 0.406: U4.2 78.97,18.82 77.47,20.32 75.25,20.32 C37.1
N$46
  Top 0.305: R16.1 86.36,31.22 | 86.36,31.22 82.02,31.22 JP4.6 | C38.1 86.67,26.99 85.72,27.94 85.72,29.84 86.36,30.48 86.36,31.22
  Top 0.406: U4.15 86.77,25.31 C38.1 | JP4.2 JP4.4 JP4.6
N$47
  Top 0.406: U4.6 81.58,13.01 81.28,12.7 81.13,12.7 R33.2
N$48
  Top 0.406: U4.9 83.52,14.91 84.45,13.97 84.45,12.22 R34.2
N$49
  Top 0.305: U1.24 16.15,26.31 JP1.5
N$50
  Top 0.406: U2.13 U2.12 42.29,16.76 43.18,15.88 45.09,15.88 45.72,16.51 45.72,22.86 46.99,24.13 49.53,24.13 51.53,26.13 R11.2
N$51  (1 unrouted)
  Top 0.406: U3.12 63.88,16.76 64.77,15.88 66.67,15.88 67.31,16.51 67.31,22.86 68.58,24.13 71.12,24.13 73.12,26.13 R15.2
N$52
  Top 0.406: U4.13 U4.12 85.47,16.76 86.36,15.88 88.27,15.88 88.9,16.51 88.9,17.78 90.9,19.78 R16.2
N$53
  Top 0.305: U1.25 15.49,27.69 JP1.3
N$54
  Top 0.254: U2.24 37.74,26.31 JP2.5
N$55
  Top 0.305: U1.26 14.86,25.78 JP1.1
N$56
  Top 0.406: C20.1 21.27,26.99 JP1.6 JP1.4 JP1.2 | R10.1 23.71,26.14 C20.1 | U1.15 22,25.81 22.86,26.67 C20.1
N$57
  Top 0.305: U2.25 37.08,27.69 JP2.3
N$58
  Top 0.305: U3.24 59.33,26.31 JP3.5
N$59
  Top 0.305: U3.25 58.67,25.15 58.42,25.4 JP3.3
N$60
  Top 0.305: U3.26 58.04,24.51 55.88,26.67 JP3.1
N$61
  Top 0.305: U4.24 80.92,26.31 81.28,26.67 JP4.5
N$62
  Top 0.305: U4.25 80.26,25.15 78.74,26.67 JP4.3
N$63
  Top 0.305: U4.26 79.63,24.51 78.74,25.4 77.47,25.4 76.2,26.67 JP4.1
PGC  (via drill 0.6)
  Top 0.254: U$1.24 56.95,41.48 56.52,41.91 v46.99,41.91
  Bottom 0.305: v46.99,41.91 43.81,45.09 43.81,47.62 INTERCON.7
PGD  (via drill 0.6)
  Top 0.254: U$1.25 56.79,41 56.52,41.27 48.26,41.27 v47.62,40.64
  Bottom 0.305: INTERCON.5 44.45,52.07 43.18,50.8 43.18,41.91 44.45,40.64 v47.62,40.64
PROBE-TRIGGER
  Top 0.254: U$1.98 61.04,62.15 60.33,62.87 56.52,62.87 46.35,73.03 34.92,73.03 31.75,76.2 31.75,77.47 PROBE.1
PWM-1
  Top 0.254: U$1.21 43,43
  Top 0.305: R6.2 R1.1 41.91,37.15 41.91,41.91 43,43
PWM-1-NEG
  Top 1.27: PWM1/2.2 3.76,35.56 D1.A 16.51,36.56 16.51,38.1 17.78,39.37 30.48,39.37 31.75,38.1 Q1.D
PWM-2
  Top 0.254: U$1.20 42.55,43.48
  Top 0.305: R3.1 R7.2 42.55,43.48
PWM-2-NEG
  Top 1.27: PWM1/2.4 2.54,46.99 11.43,46.99 12.7,45.72 D2.A 16.51,46.72 16.51,48.26 17.78,49.53 30.48,49.53 31.75,48.26 Q3.D
PWM-3
  Top 0.254: U$1.19 44.91,43.99
  Top 0.305: R4.1 R8.2 42.55,54.61 43.18,53.98 43.18,45.72 44.45,44.45 44.91,43.99
PWM-3-NEG
  Top 1.27: PWM3/4.2 10.18,58.4 12.7,55.88 D3.A 15.51,57.42 17.78,59.69 30.48,59.69 31.75,58.42 Q4.D
PWM-4
  Top 0.254: U$1.18 45.67,44.5 45.09,45.09
  Top 0.305: R5.1 R9.2 42.55,64.77 43.81,63.5 43.81,46.35 45.09,45.09
PWM-4-NEG
  Top 1.27: PWM3/4.4 12.99,68.56 D4.A 15.51,67.58 17.78,69.85 29.21,69.85 31.75,67.31 Q5.D
SW-EMERGENCY
  Top 0.254: U$1.100 60.05,59.33 59.69,59.69 55.88,59.69 43.81,71.75 13.34,71.75 10.16,74.93 10.16,77.47 SW.1
SW-PAUSE
  Top 0.254: U$1.99 60.53,60.12 59.69,60.96 57.15,60.96 45.72,72.39 24.13,72.39 20.32,76.2 20.32,77.47 SW.3
T-EXT1  (via drill 0.6)
  Top 0.254: U$1.42 68.05,46.46 v69.85,48.26
  Top 0.305: v87,39.37 87,37.47 | 87,37.47 86.36,36.83 85.41,36.83 R13.2 | 87,37.47 92.08,37.47 93.98,35.56 93.98,30.53 T1/2.1
  Bottom 0.254: v69.85,48.26 71.75,46.35
  Bottom 0.305: v87,39.37 81.28,39.37 80.01,40.64 80.01,43.18 76.83,46.35 71.75,46.35
T-EXT2  (via drill 0.6)
  Top 0.254: U$1.43 68.53,45.03 v69.85,46.35
  Top 0.305: R14.2 v82.55,35.56
  Bottom 0.254: v69.85,46.35 70.48,46.35 71.12,45.72 76.2,45.72
  Bottom 0.305: T1/2.3 97.79,16.51 96.52,16.51 93.98,19.05 93.98,22.86 82.55,34.29 v82.55,35.56 78.74,39.37 78.74,43.18 76.2,45.72
T-PROC  (via drill 0.6)
  Top 0.254: U$1.44 69.04,43.64 v69.85,44.45
  Top 0.305: R23.1 R19.2 79.69,37.47 v78.11,37.47
  Bottom 0.305: v69.85,44.45 76.2,44.45 77.47,43.18 77.47,38.1 v78.11,37.47
TL-PROBE
  Top 0.254: U$1.97 61.54,62.92 60.96,63.5 57.15,63.5 46.99,73.66 43.18,73.66 41.91,74.93 41.91,77.47 PROBE.3
UART_RX  (via drill 0.5)
  Top 0.254: U$1.11 56.79,47.98 v56.52,48.26
  Bottom 0.305: v56.52,48.26 55.88,48.26 55.24,48.9 48.9,48.9 INTERCON.8
UART_TX  (via drill 0.5)
  Top 0.254: U$1.10 57.56,48.49 v56.52,49.53
  Top 0.305: v50.16,50.16 50.16,48.9 INTERCON.10
  Bottom 0.305: v56.52,49.53 55.88,50.16 v50.16,50.16
VCC  (8 unrouted)
  Top 0.406: U1.4 15.49,15.49 15.24,15.24 13.65,15.24 C8.2 | C7.1 | U1.11 20.07,16.13 20.95,15.24 22.55,15.24 C16.2 | C21.1 | U2.4 37.08,15.49 36.83,15.24 35.24,15.24 C23.2 | U2.11 41.66,16.13 42.55,15.24 44.13,15.24 C22.2 | U3.4 58.67,15.49 58.42,15.24 56.84,15.24 C28.2 | U3.11 63.25,16.13 64.14,15.24 65.72,15.24 C30.2 | U4.4 80.26,15.49 80.01,15.24 78.42,15.24 C34.2 | C33.1 | C35.2 87.31,15.24 85.72,15.24 84.84,16.13 U4.11
  Top 0.813: PWR.3 2.56,20.3 4.45,18.41 4.45,12.07 PWR.1
  Top 1.27: 71.12,5.71 88.27,5.71 89.22,6.67 C36.2 87.95,11.43 C35.2 | 71.12,5.71 66.04,5.71 | 66.04,5.71 49.53,5.71 | 49.53,5.71 44.45,5.71 | 44.45,5.71 27.94,5.71 | 27.94,5.71 22.86,5.71 | 22.86,5.71 10.16,5.71 | 10.16,5.71 6.94,5.71 PWR.1 | C34.2 75.88,14.29 74.3,12.7 74.3,8.89 71.12,5.71 | C33.1 R35.1 | C30.2 66.36,11.43 C29.2 67.63,7.3 66.04,5.71 | C28.2 53.66,14.29 52.07,12.7 52.07,8.26 49.53,5.71 | C27.1 R32.1 | C22.2 44.77,11.11 45.72,10.16 C24.2 46.04,7.3 44.45,5.71 | C23.2 32.06,14.29 | 32.06,14.29 30.48,12.7 30.48,8.26 27.94,5.71 | 32.06,14.29 R29.1 | C16.2 23.18,11.43 C17.2 24.45,7.3 22.86,5.71 | C8.2 10.47,14.29 8.89,12.7 8.89,6.99 10.16,5.71 | C7.1 R26.1 | C3.2 9.53,30.48 | 9.53,30.48 9.53,29.84 | 9.53,29.84 9.53,26.04 6.35,22.86 5.08,22.86 2.54,20.32 | D2.C 20.32,45.45 20.32,43.18 19.37,42.23 C4.2 2.86,42.23 PWM1/2.3 | D3.C 20.32,55.61 20.32,53.34 20,53.02 C5.2 2.85,53.02 2.54,53.34 | 2.81,53.02 PWM3/4.1 | PWM3/4.3 2.81,63.19 C6.2 19,63.19 20.59,64.77 D4.C | D1.C 20.59,33.29 20.32,33.02 12.7,33.02 9.53,29.84 | PWM1/2.1 7.01,31.73 8.26,30.48 9.53,30.48
  Bottom 1.27: PWM1/2.3 5.1,41.89 6.35,40.64 6.35,35.56 2.54,31.75 | PWM3/4.1 3.81,53.32 | 3.81,53.32 5.1,53.32 6.35,52.07 6.35,44.45 3.81,41.91 2.54,41.91 | PWM3/4.3 5.1,63.48 6.35,62.23 6.35,55.86 3.81,53.32
X-DIR  (via drill 0.6)
  Top 0.254: U$1.27 60.53,38.3 60.33,38.1 57.78,38.1 56.52,39.37 v55.88,39.37 | 18.75,24.43 18.75,25.07 v18.41,25.4
  Top 0.305: U1.20 18.75,24.43
  Bottom 0.254: v18.41,25.4 18.41,26.67 22.86,31.11 22.86,31.75 24.13,33.02
  Bottom 0.305: v55.88,39.37 48.26,39.37 41.91,33.02 24.13,33.02
X-ENABLE  (via drill 0.6)
  Top 0.254: U$1.29 61.54,38.05 60.33,36.83 v53.34,36.83
  Top 0.305: U1.17 20.7,25.15 v20.95,25.4
  Bottom 0.305: v53.34,36.83 48.26,36.83 43.18,31.75 25.4,31.75 20.95,27.3 v20.95,25.4
X-FAULT  (via drill 0.6)
  Top 0.254: U$1.28 61.04,38.18 60.33,37.47 57.15,37.47 56.52,38.1 v54.61,38.1
  Top 0.305: U1.18 20.07,24.38 19.68,24.77 v19.68,26.67
  Bottom 0.254: v19.68,26.67 21.59,28.57 21.59,29.21 24.77,32.38
  Bottom 0.305: v54.61,38.1 48.26,38.1 42.55,32.38 24.77,32.38
X-LIMIT-MAX
  Top 0.254: U$1.92 64.03,55.78 66.04,57.78 66.04,69.85 67.31,71.12 82.55,71.12 85.09,73.66 85.09,77.47 X-LIMIT.3
  Bottom 0.305: 85.09,77.47 X-LIMIT.3
X-LIMIT-MIN
  Top 0.254: U$1.93 63.55,55.93 65.41,57.78 65.41,70.48 67.31,72.39 74.3,72.39 74.93,73.03 74.93,77.47 X-LIMIT.1
X-STEP  (via drill 0.6)
  Top 0.254: U$1.26 57.78,39.37 56.52,40.64 54.61,40.64 52.07,38.1
  Top 0.305: U1.22 17.45,24.46 v17.14,24.77 | v44.45,38.1 52.07,38.1
  Bottom 0.305: v17.14,24.77 17.14,26.04 16.51,26.67 16.51,31.75 17.78,33.02 17.78,36.83 19.05,38.1 v44.45,38.1
Y-DIR  (via drill 0.6)
  Top 0.254: U$1.33 63.55,41.22 62.23,42.55 61.59,42.55 v60.33,43.81
  Top 0.305: U2.20 40.34,25.07 v40.01,25.4
  Bottom 0.254: 61.59,39.37 61.59,42.55 v60.33,43.81 | v40.01,25.4 40.01,26.04 48.9,34.92
  Bottom 0.305: 61.59,39.37 57.15,34.92 48.9,34.92
Y-ENABLE  (via drill 0.6)
  Top 0.254: U2.17 42.29,24.51 v42.55,24.77
  Top 0.305: U$1.35 64.54,43.41 v64.14,43.81
  Bottom 0.254: 57.78,33.02 49.53,33.02 44.45,27.94 44.45,26.67 v42.55,24.77
  Bottom 0.305: v64.14,43.81 64.14,39.37 57.78,33.02
Y-FAULT  (via drill 0.6)
  Top 0.254: U2.18 41.66,24.38 41.27,24.77 41.27,26.04 v41.91,26.67 | U$1.34 64.03,41.38 62.23,43.18 v62.23,43.81
  Bottom 0.254: v41.91,26.67 48.9,33.66 | 62.87,39.37 62.87,42.55 62.23,43.18 v62.23,43.81
  Bottom 0.305: 62.87,39.37 57.15,33.66 48.9,33.66
Y-LIMIT-MAX  (via drill 0.6)
  Top 0.254: U$1.90 65.05,51.71 v64.14,50.8
  Bottom 0.254: v64.14,50.8 73.03,59.69 97.79,59.69
  Bottom 0.305: 97.79,59.69 Y-LIMIT.3
Y-LIMIT-MIN  (via drill 0.6)
  Top 0.254: U$1.91 64.54,53.11 v64.14,52.7
  Bottom 0.305: v64.14,52.7 81.28,69.85 97.79,69.85 Y-LIMIT.1
Y-STEP  (via drill 0.6)
  Top 0.254: U$1.32 63.04,41.1 62.87,41.27 v60.33,41.27
  Top 0.305: U2.22 39.04,25.09 38.73,25.4 v38.73,26.04
  Bottom 0.254: v38.73,26.04 39.37,26.67 40.01,26.67 46.99,33.66
  Bottom 0.305: v60.33,41.27 60.33,39.37 56.52,35.56 48.26,35.56 46.99,34.29 46.99,33.66
Z-DIR  (via drill 0.6)
  Top 0.254: U$1.39 66.55,41.78 v66.67,41.91
  Top 0.305: U3.20 61.92,24.46 v62.23,24.77
  Bottom 0.254: 64.14,36.96 64.14,27.94 62.23,26.04 v62.23,24.77
  Bottom 0.305: v66.67,41.91 66.67,39.37 66.04,38.73 65.91,38.73 64.14,36.96
Z-ENABLE  (via drill 0.6)
  Top 0.254: U3.17 63.88,24.51 64.14,24.77 64.77,24.77 v66.04,26.04 | U$1.41 67.54,37.87 67.94,37.47 v68.58,37.47
  Bottom 0.254: v68.58,37.47 67.94,36.83 67.94,32.38 66.04,30.48 v66.04,26.04
Z-FAULT  (via drill 0.6)
  Top 0.254: U$1.40 67.03,37.82 v66.67,37.47
  Top 0.305: U3.18 63.25,25.15 v64.14,26.04
  Bottom 0.254: v66.67,37.47 66.67,31.75 64.77,29.84 64.77,26.67 v64.14,26.04
Z-LIMIT-MAX  (via drill 0.6)
  Top 0.254: U$1.88 66.04,53.34 v67.94,51.44
  Bottom 0.305: v67.94,51.44 69.22,52.7 92.08,52.7 93.98,50.8 93.98,41.96 Z-LIMIT.3
Z-LIMIT-MIN  (via drill 0.6)
  Top 0.254: U$1.89 65.53,51.94 v66.04,51.44
  Bottom 0.305: v66.04,51.44 67.94,53.34 92.76,53.34 Z-LIMIT.1
Z-STEP  (via drill 0.6)
  Top 0.254: U$1.38 66.04,40.64 65.41,41.27 v65.41,45.09
  Top 0.305: U3.22 60.63,25.7 v60.96,26.04
  Bottom 0.305: v65.41,45.09 65.41,39.37 63.5,37.47 63.5,27.94 61.59,26.04 v60.96,26.04